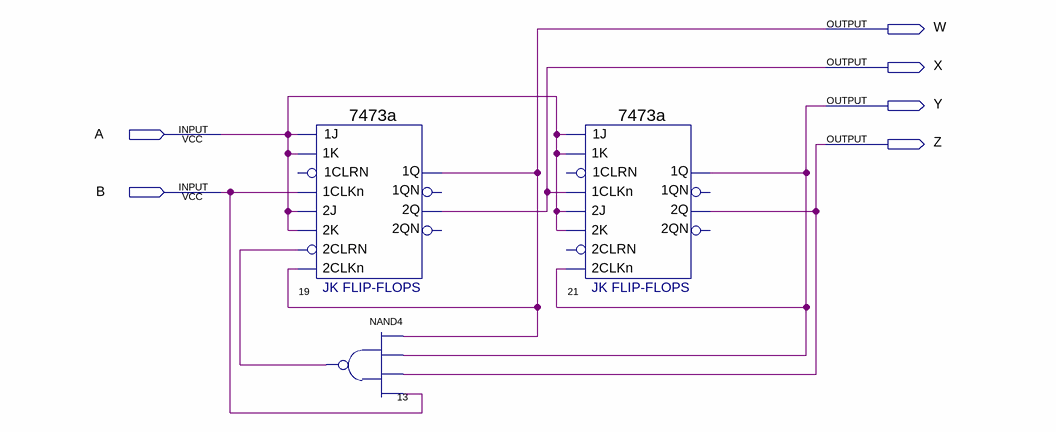
[diagram p0: schematic sheet]
// Quartus schematic analyse_stud_01.bdf as structural Verilog: 3 symbols, 6 pins
module analyse_stud_01 (
  input  A,
  input  B,
  output W,
  output X,
  output Y,
  output Z
);

  wire n13_out;

  \7473a  u_19 (
    .\2J (A), .\1CLKn (B), .\1K (A), .\2CLKn (W), .\2CLRN (n13_out), .\2K (A), .\1J (A), .\2Q (X), .\1Q (W));  // open: 1CLRN, 2QN, 1QN
  nand u_13 (n13_out, W, Y, Z, B);
  \7473a  u_21 (
    .\2J (A), .\1CLKn (X), .\1K (A), .\2CLKn (Y), .\2K (A), .\1J (A), .\2Q (Z), .\1Q (Y));  // open: 1CLRN, 2CLRN, 2QN, 1QN
endmodule
